# EasyEDA Pro project ProDoc_智能家居扩展板_2024-11-17.epro

# Schematic 智能家居扩展板
Board Name: 智能家居扩展板; Create Date: 2024-08-14; Page Name: P1; Project Name: 树莓派扩展板; Schematic Name: 智能家居扩展板; Update Date: 2024-10-30; Company: 嘉立创EDA; Page Size: A4; Version: V1.0
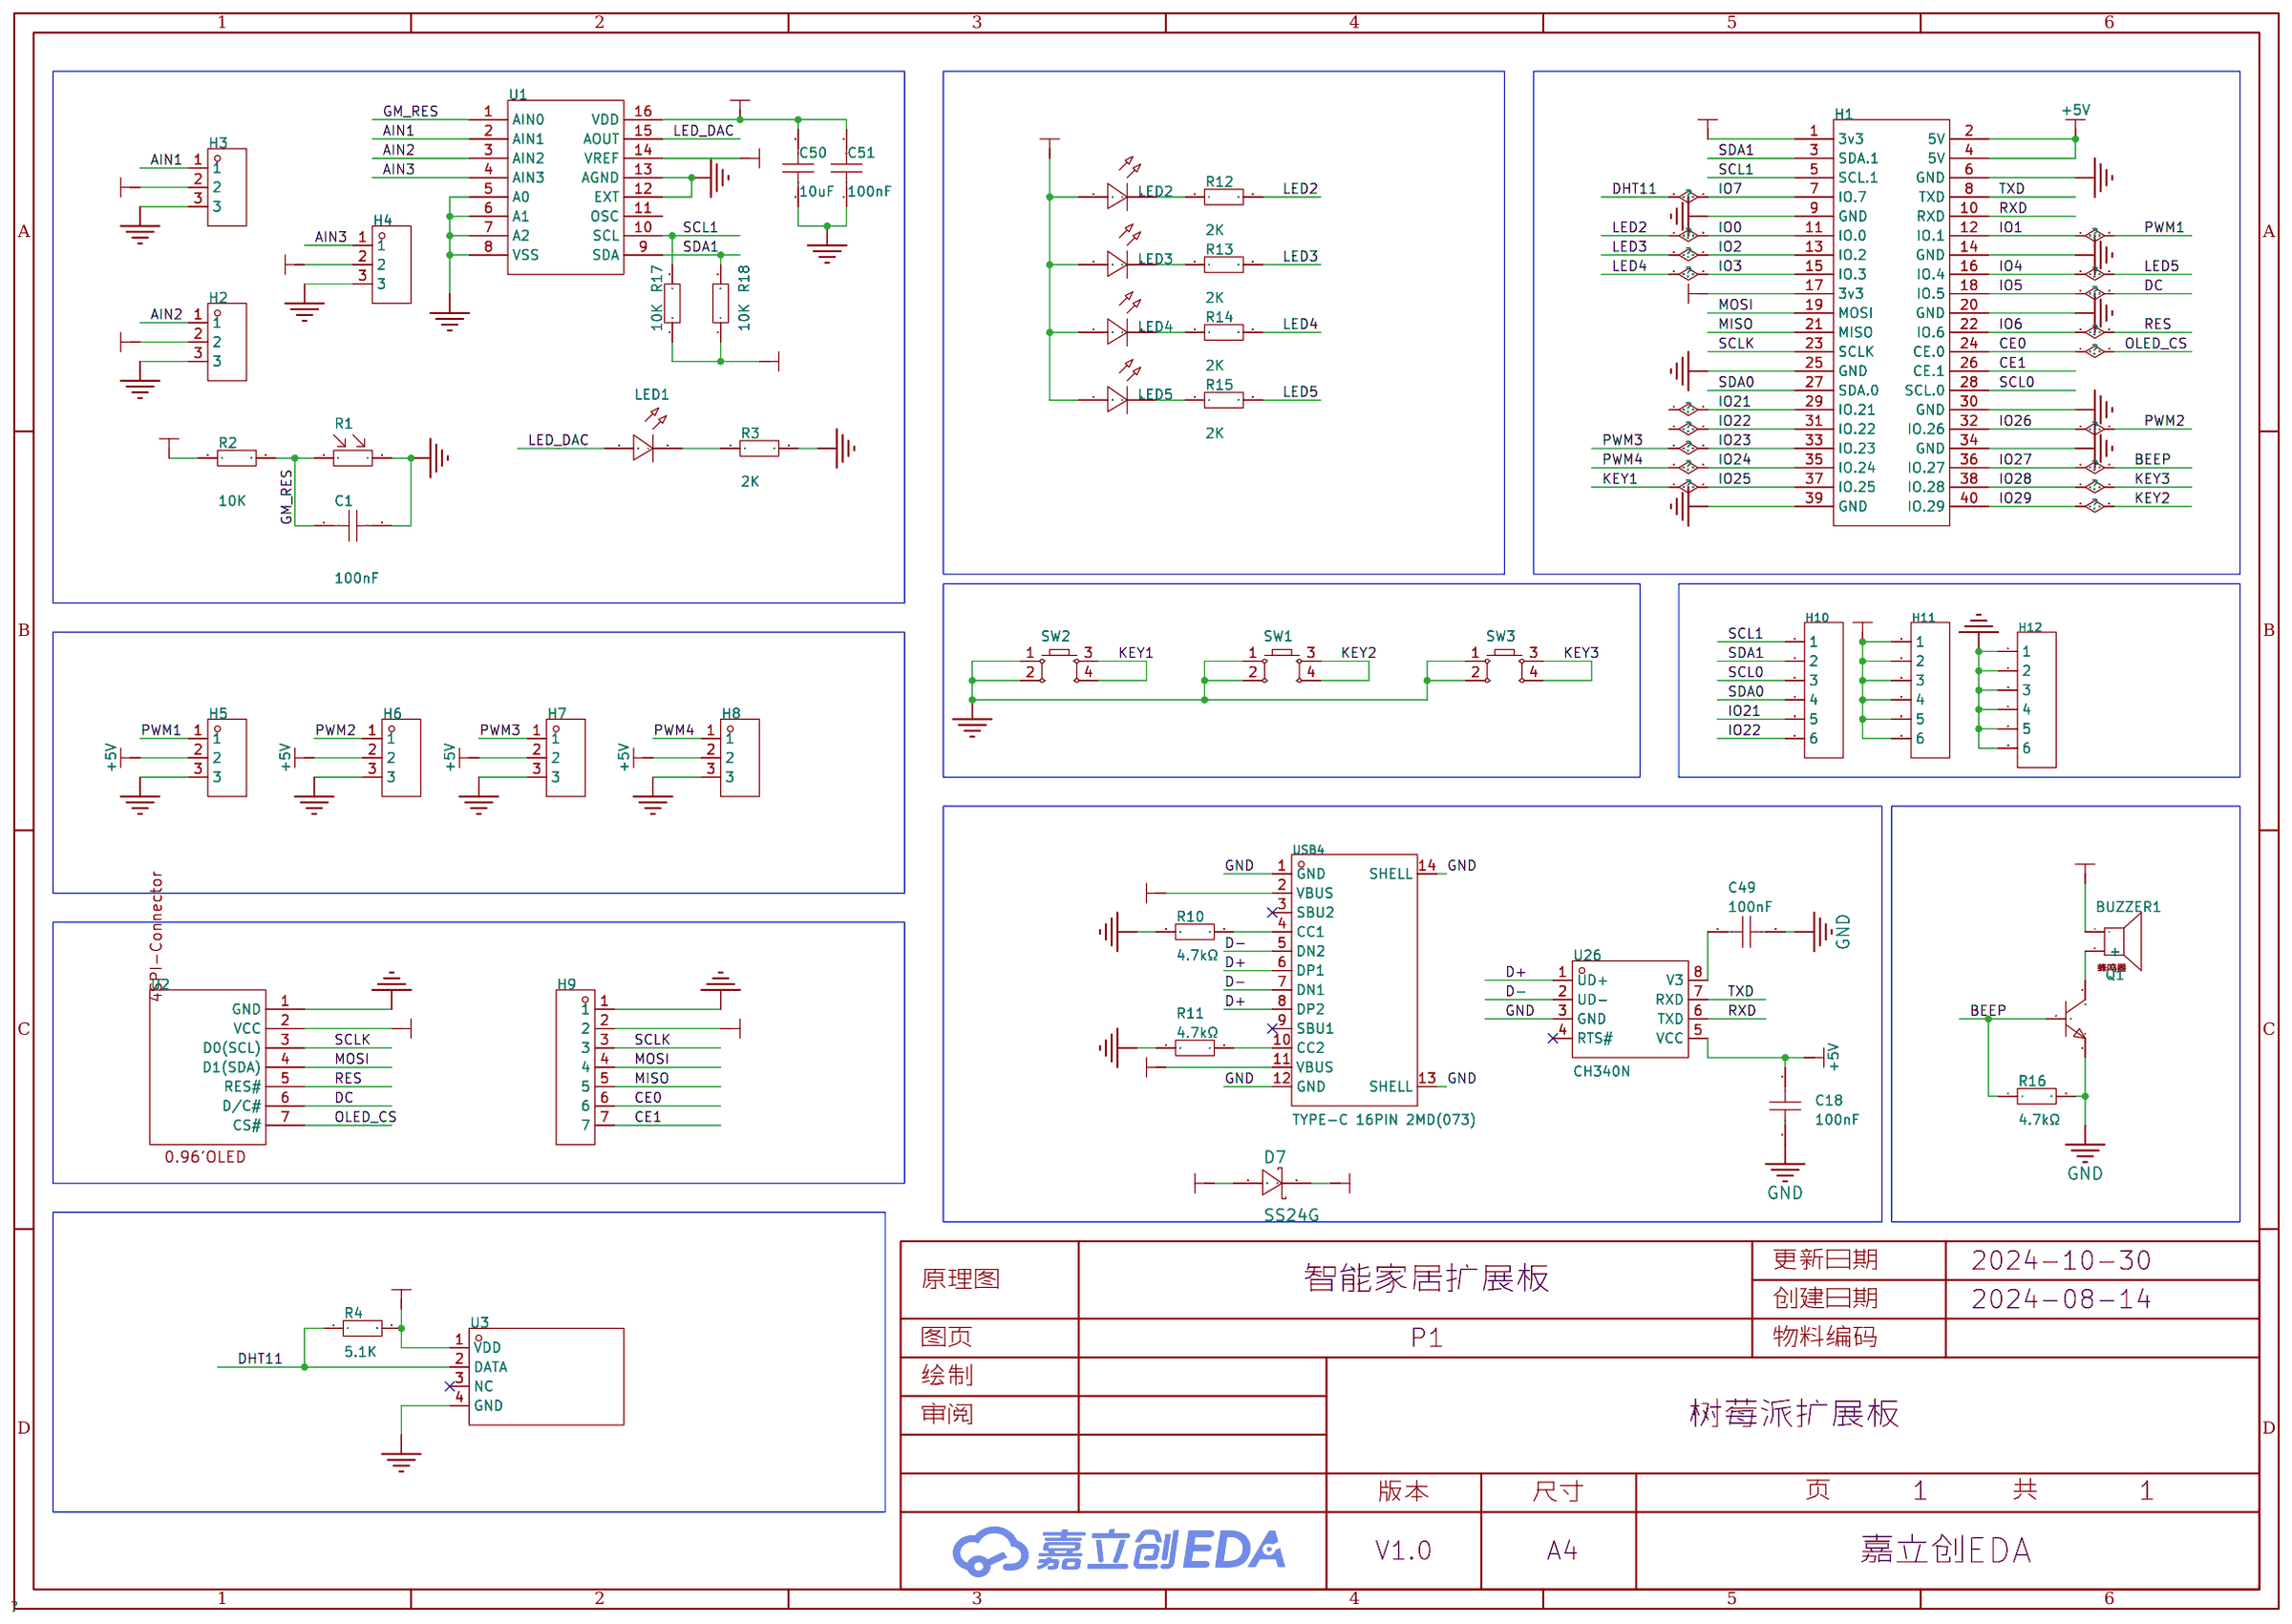
[diagram p0: schematic sheet]

## Parts
BUZZER1  蜂鸣器0905  [蜂鸣器0905]
C1  100nF  [C0603]
C18  100nF  [C0603]
C49  100nF  [C0603]
C50  10uF  [C0603]
C51  100nF  [C0603]
D7  SS24G  [SMA_L4.4-W2.8-LS5.4-RD]
H1  -  [HDR-TH_12P-P2.54-V-M-R2-C6-S2.54]
H2  -  [HDR-TH_3P-P2.54-V-M]
H3  -  [HDR-TH_3P-P2.54-V-M]
H4  -  [HDR-TH_3P-P2.54-V-M]
H5  -  [HDR-TH_3P-P2.54-V-M]
H6  -  [HDR-TH_3P-P2.54-V-M]
H7  -  [HDR-TH_3P-P2.54-V-M]
H8  -  [HDR-TH_3P-P2.54-V-M]
H9  -  [HDR-TH_7P-P2.54-V-M]
H10  -  [HDR-TH_6P-P2.54-V-M-1]
H11  -  [HDR-TH_6P-P2.54-V-M-1]
H12  -  [HDR-TH_6P-P2.54-V-M-1]
LED1  -  [LED_TH-3mm]
LED2  -  [LED_TH-3mm]
LED3  -  [LED_TH-3mm]
LED4  -  [LED_TH-3mm]
LED5  -  [LED_TH-3mm]
Q1  -  [SOT-23-3_L2.9-W1.3-P1.90-LS2.4-BR]
R1  GL5506（4-7K）  [RES-TH_L5.1-W4.3-P3.00-D0.5]
R2  10K  [R0603]
R3  2K  [R0603]
R4  5.1K  [R0603]
R10  4.7kΩ  [R0603]
R11  4.7kΩ  [R0603]
R12  2K  [R0603]
R13  2K  [R0603]
R14  2K  [R0603]
R15  2K  [R0603]
R16  4.7kΩ  [R0603]
R17  10K  [R0603]
R18  10K  [R0603]
SW1  -  [SW-SMD_4P-L6.0-W6.0-P4.50-LS9.0-2]
SW2  -  [SW-SMD_4P-L6.0-W6.0-P4.50-LS9.0-2]
SW3  -  [SW-SMD_4P-L6.0-W6.0-P4.50-LS9.0-2]
U1  PCF8591T/2,518  [SOIC-16_L10.3-W7.5-P1.27-LS10.3-BL]
U2  0.96'OLED-SPI(7Pin)_JX  [OLED-TH_JX040101-1]
U3  DHT11  [sensor-th_dht11]
U26  CH340N  [SOP-8_L4.9-W3.9-P1.27-LS6.0-BL]
USB4  TYPE-C 16PIN 2MD(073)  [USB-C-SMD_TYPE-C-6PIN-2MD-073]

## Library data of the parts
BUZZER1 = 蜂鸣器0905: _: undefined; 3DModel: User Library-Kobitone_Buzzer; Supplier: LCSC; Manufacturer: HNDZ; Manufacturer Part: TMB12A12; Supplier Part: C96079; JLCPCB Part Class: 扩展库
C1 C50 C51 = CAP_0603: Supplier Footprint: 0603
C18 C49 = CC0603KRX7R8BB104: 容值:100nF;精度:±10%;额定电压:25V;材质(温度系数):X7R;; LCSC Part Name: 100nF ±10% 25V; Supplier Part: C92490; Manufacturer: YAGEO(国巨); Supplier Footprint: 0603; JLCPCB Part Class: Extended Part; Datasheet: https://atta.szlcsc.com/upload/public/pdf/source/20170105/1483610795587.pdf; Supplier: LCSC; Tolerance: ±10%; Voltage Rated: 25V; Temperature Coefficient: X7R
D7 = SS24G: Supplier: LCSC; Supplier Part: C183481; Manufacturer: SK; JLCPCB Part Class: Extended Part
H1 = HDR-F_2.54_2x20: Rasspberry; Supplier Part: C92270; Supplier Footprint: 插件
H2-H8 = HDR-M_2.54_1x3P: Supplier Part: C2937625; Supplier Footprint: 插件
H9 = HDR-M_2.54_1x7P: Supplier Part: C492406; Supplier Footprint: 插件
H10-H12 = HDR-M_2.54_1x6P: Supplier Part: C37208; Supplier Footprint: 插件
LED1-LED5 = LED_TH-R_3mm: Supplier Footprint: 插件
Q1 = NPN: 晶体管类型:NPN;集射极击穿电压(Vceo):40V;集电极电流(Ic):600mA;功率(Pd):300mW;集电极-发射极饱和电压(VCE(sat)@Ic,Ib):1V@500mA,50mA;直流电流增益(hFE@Ic,Vce):-;特征频率(fT):300MHz;工作温度:+150℃@(Tj);; LCSC Part Name: MMBT2222A 1P; Supplier Part: C8512; Manufacturer: CJ（江苏长电/长晶）; Manufacturer Part: MMBT2222A 1P; Supplier Footprint: SOT-23(SOT-23-3); JLCPCB Part Class: Basic Part; Datasheet: https://atta.szlcsc.com/upload/public/pdf/source/20140815/1457707223705.pdf; Supplier: LCSC; Collector-Emitter Breakdown Voltage (Vceo): 40V; Collector Current (Ic): 600mA; Power Dissipation (Pd): 300mW; Collector-Emitter Saturation Voltage (VCE(sat)@Ic,Ib): 1V@500mA,50mA; Transition Frequency (fT): 300MHz; Operating Temperature: +150℃@(Tj)
R1 = GL5506(4-7K): 光谱峰值(波长):540nm;最大电压:150V;亮电阻 @ 10Lux:4kΩ~7kΩ;暗电阻:500kΩ;; LCSC Part Name: GL5506（4-7K）不环保; Supplier Part: C11299; Manufacturer: JCHL(晶创和立); Supplier Footprint: 插件,P=3mm; JLCPCB Part Class: Extended Part; Datasheet: https://atta.szlcsc.com/upload/public/pdf/source/20151026/1457707497809.pdf; Supplier: LCSC; Spectral Peak: 540nm; Applied Voltage: 150V; Illuminated Resistance @ 10Lux: 4kΩ~7kΩ; Dark Resistance: 500kΩ
R2-R4 R12-R15 R17 R18 = Res_0603: Supplier Footprint: 0603
R10 R11 R16 = 0603WAF4701T5E: 电阻类型:厚膜电阻;阻值:4.7kΩ;精度:±1%;功率:100mW;最大工作电压:75V;温度系数:±100ppm/℃;; LCSC Part Name: 4.7kΩ ±1% 100mW 厚膜电阻; Supplier Part: C23162; Manufacturer: UNI-ROYAL(厚声); Supplier Footprint: 0603; JLCPCB Part Class: Basic Part; Datasheet: https://atta.szlcsc.com/upload/public/pdf/source/20200306/C422600_1E6D84923E4A46A82E41ADD87F860B5C.pdf; Supplier: LCSC; Type: 厚膜电阻; Tolerance: ±1%; Power(Watts): 100mW; Overload Voltage (Max): 75V; Temperature Coefficient: ±100ppm/℃; Operating Temperature Range: -55℃~+155℃
SW1-SW3 = Key_SMD_6x6x6.5: Supplier Footprint: SMD
U1 = PCF8591T/2,518: LCSC Part Name: PCF8591T/2,518 停产; Supplier Part: C8366; Manufacturer: NXP(恩智浦); Supplier Footprint: SOIC-16-300mil; JLCPCB Part Class: 扩展库; Supplier: LCSC
U2 = 0.96'OLED-SPI(7Pin)_JX: Supplier Part: C9900004517; Supplier Footprint: 插件; JLCPCB Part Class: 扩展库; Supplier: LCSC
U3 = DHT11: 新款电容式数字温湿度传感器,老款已停产16.1x12.6x5.8mm; LCSC Part Name: DHT11  电容式传感器; Supplier Part: C117051; Manufacturer: 广州奥松; Supplier Footprint: SIP-4; JLCPCB Part Class: Extended Part; Datasheet: https://atta.szlcsc.com/upload/public/pdf/source/20170703/1499081238365.pdf; Supplier: LCSC
U26 = CH340N: LCSC Part Name: USB转串口芯片 CH340; Supplier Part: C2977777; Manufacturer: WCH(南京沁恒); Supplier Footprint: SOP-8; JLCPCB Part Class: 扩展库; Datasheet: https://atta.szlcsc.com/upload/public/pdf/source/20230530/6E401E9554E9F5311886CC8B3F89B62E.pdf; Supplier: LCSC
USB4 = TYPE-C 16PIN 2MD(073): 连接器类型:Type-C;标准:-;公母:母座;触点数量:16;端口数量:1;安装方式:卧贴;额定电流 - 电源:5A;工作温度范围:-25℃~+85℃;; LCSC Part Name: TYPE-C母座 16P 4脚插件带定位柱 不锈钢外壳 2次模顶; Supplier Part: C2765186; Manufacturer: SHOU HAN(首韩); Supplier Footprint: SMD; JLCPCB Part Class: 扩展库; Supplier: LCSC; Connector Type: Type-C; Gender: 母座; Number of Contacts: 16; Number of Ports: 1; Mounting Style: 卧贴; Current Rating - Power (Max): 5A; Operating Temperature Range: -25℃~+85℃

## Nets
3V3: BUZZER1.- C50.2 C51.2 H1.1(3v3) H1.17(3v3) H2.2 H3.2 H4.2 H9.2 H11.1 H11.2 H11.3 H11.4 H11.5 H11.6 LED2.1(C) LED3.1(C) LED4.1(C) LED5.1(C) R2.1 R4.2 R17.1 R18.1 U1.14(VREF) U1.16(VDD) U2.2(VCC) U3.1(VDD)
+5V: C18.2 D7.1 H1.2(5V) H1.4(5V) H5.2 H6.2 H7.2 H8.2 U26.5(VCC)
GND: C1.2 C18.1 C49.2 C50.1 C51.1 H1.6(GND) H1.9(GND) H1.14(GND) H1.20(GND) H1.25(GND) H1.30(GND) H1.34(GND) H1.39(GND) H2.3 H3.3 H4.3 H5.3 H6.3 H7.3 H8.3 H9.1 H12.1 H12.2 H12.3 H12.4 H12.5 H12.6 Q1.2(E) R1.2 R3.2 R10.1 R11.1 R16.2 SW1.1 SW1.2 SW2.1 SW2.2 SW3.1 SW3.2 U1.5(A0) U1.6(A1) U1.7(A2) U1.8(VSS) U1.12(EXT) U1.13(AGND) U2.1(GND) U3.4(GND) U26.3(GND) USB4.1(GND) USB4.12(GND) USB4.13(SHELL) USB4.14(SHELL)
VBUS: D7.2 USB4.2(VBUS) USB4.11(VBUS)
AIN1: H3.1 U1.2(AIN1)
AIN2: H2.1 U1.3(AIN2)
AIN3: H4.1 U1.4(AIN3)
BEEP: H1.36(IO.27) Q1.1(B) R16.1
CE0: H1.24(CE.0) H9.6 U2.7(CS#)
CE1: H1.26(CE.1) H9.7
D+: U26.1(UD+) USB4.6(DP1) USB4.8(DP2)
D-: U26.2(UD-) USB4.5(DN2) USB4.7(DN1)
DC: H1.18(IO.5) U2.6(D/C#)
DHT11: H1.7(IO.7) R4.1 U3.2(DATA)
GM_RES: C1.1 R1.1 R2.2 U1.1(AIN0)
IO0: H1.11(IO.0) R12.2
IO1: H1.12(IO.1) H5.1
IO2: H1.13(IO.2) R13.2
IO3: H1.15(IO.3) R14.2
IO4: H1.16(IO.4) R15.2
IO6: H1.22(IO.6) U2.5(RES#)
IO21: H1.29(IO.21) H10.5
IO22: H1.31(IO.22) H10.6
IO23: H1.33(IO.23) H7.1
IO24: H1.35(IO.24) H8.1
IO25: H1.37(IO.25) SW2.3 SW2.4
IO26: H1.32(IO.26) H6.1
IO28: H1.38(IO.28) SW3.3 SW3.4
IO29: H1.40(IO.29) SW1.3 SW1.4
LED_DAC: LED1.1(C) U1.15(AOUT)
MISO: H1.21(MISO) H9.5
MOSI: H1.19(MOSI) H9.4 U2.4(D1(SDA))
RXD: H1.10(RXD) U26.6(TXD)
SCL0: H1.28(SCL.0) H10.3
SCL1: H1.5(SCL.1) H10.1 R17.2 U1.10(SCL)
SCLK: H1.23(SCLK) H9.3 U2.3(D0(SCL))
SDA0: H1.27(SDA.0) H10.4
SDA1: H1.3(SDA.1) H10.2 R18.2 U1.9(SDA)
TXD: H1.8(TXD) U26.7(RXD)
$1N1552: LED1.2(A) R3.1
$1N3312: R10.2 USB4.4(CC1)
$1N3313: R11.2 USB4.10(CC2)
$1N3325: C49.1 U26.8(V3)
$1N3429: LED2.2(A) R12.1
$1N3496: LED3.2(A) R13.1
$1N3547: LED4.2(A) R14.1
$1N3598: LED5.2(A) R15.1
$1N4766: BUZZER1.+ Q1.3(C)

Not connected (* = marked no-connect by the designer): U1 11(OSC); U3 3(NC)*; U26 4(RTS#)*; USB4 3(SBU2)* 9(SBU1)*

# Board PCB1
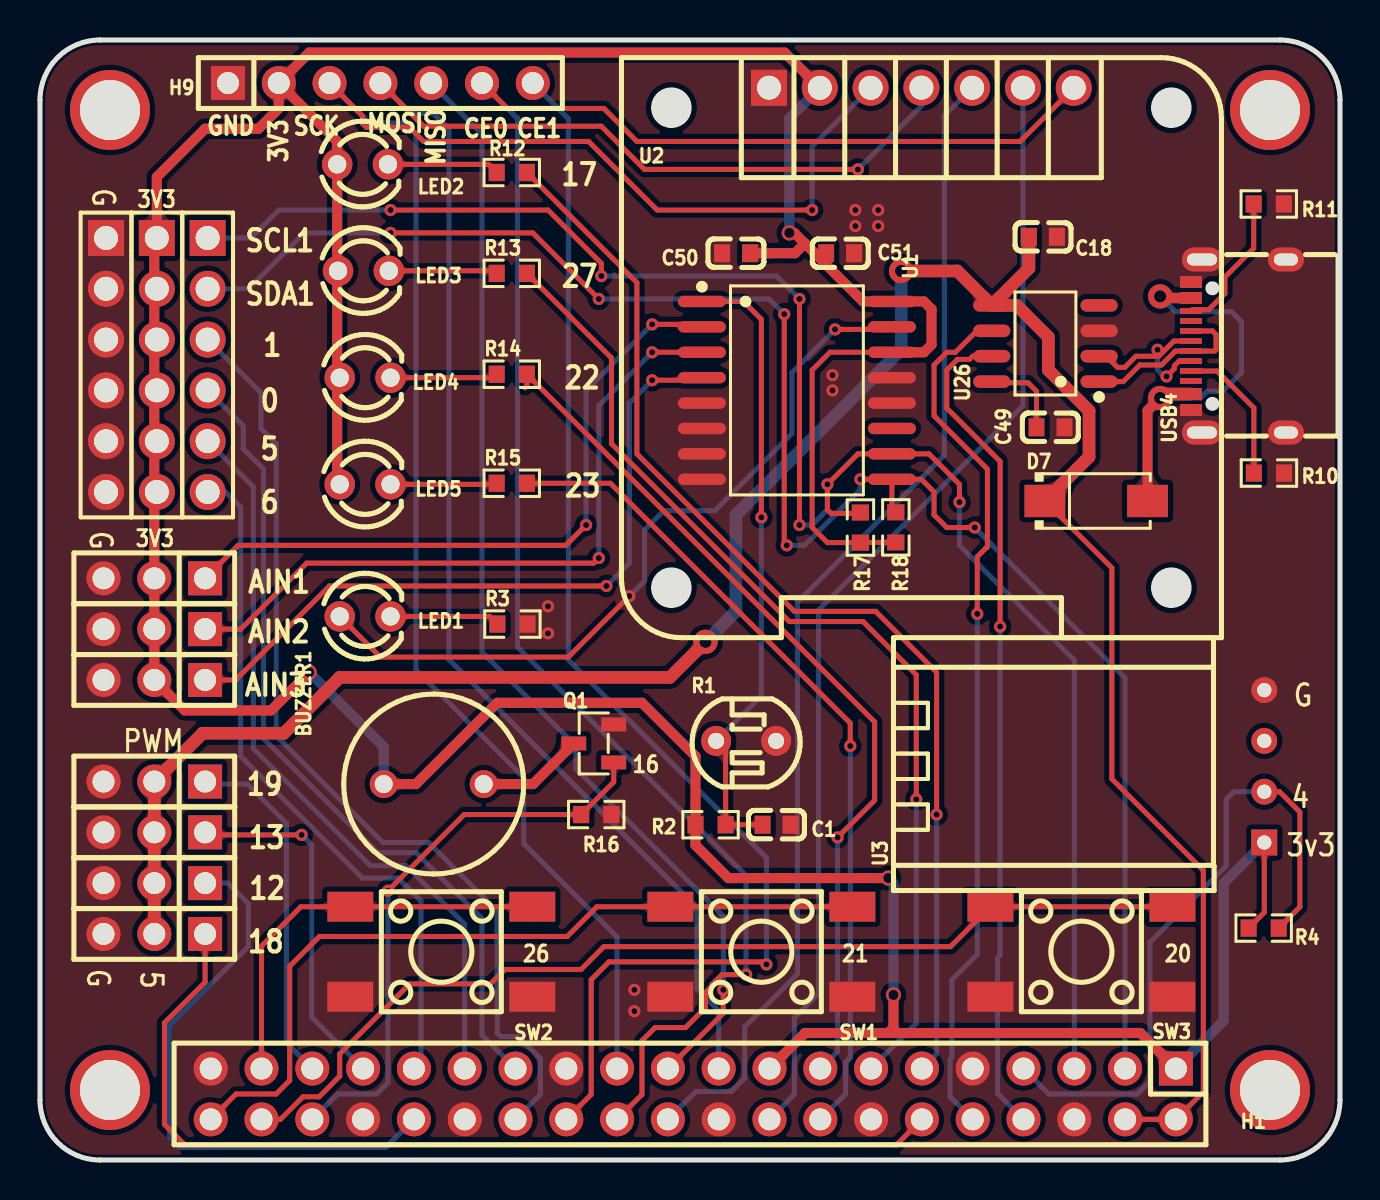
[diagram p1: board, top side]
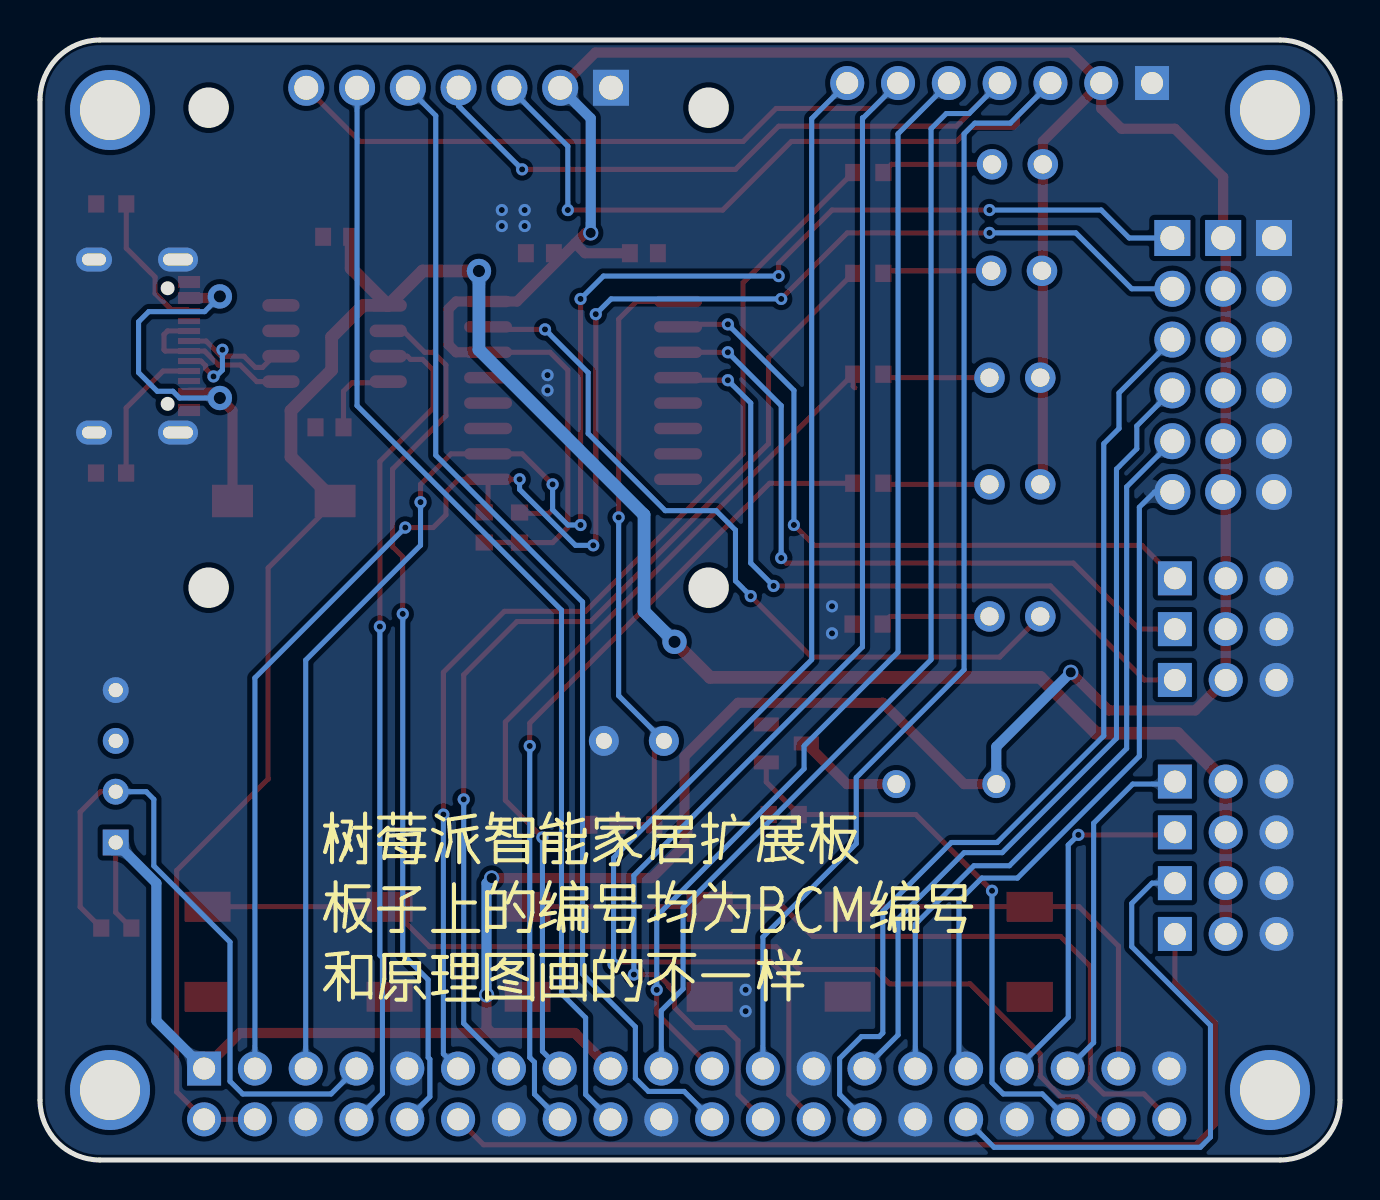
[diagram p2: board, bottom side, seen from below]

Outline 65 x 56 mm; copper layers: Top Layer, Bottom Layer. Coordinates in mm from the lower left corner of the outline.
Outline path: 0,53 0,3 arc(0.88,0.88) 3,0 62,0 arc(64.12,0.88) 65,3 65,53 arc(64.12,55.12) 62,56 3,56 arc(0.88,55.12) 0,53
Stack: Top Layer 0.035mm / Dielectric1 1.51mm FR4 er 4.5 / Bottom Layer 0.035mm

## Design rules (mm)
net D+: DP1
net D-: DP1
template: 自定义配置
spacing copperThickness1oz (default): track to track 0.102, other pairs 0.152 to 0.3
spacing copperThickness2oz: track to track 0.203, other pairs 0.152 to 0.3
track width copperThickness1oz (default): min 0.127, default 0.254, max 2.54
track width copperThickness2oz: min 0.203, default 0.254, max 2.54
differential pair differentialPair (default): width min 0.127, default 0.254, max 2.54; gap min 0.152, default 0.152
via viaSize (default): diameter min 0.5, default 0.61, max 10; hole min 0.3, default 0.305, max 6.3

## Placement (name value [footprint] x y rotation side)
BUZZER1  -  [蜂鸣器0905]  19.69 18.8 180 top
C1  100nF  [C0603]  36.83 16.76 0 top
C18  100nF  [C0603]  50.14 46.16 180 top
C49  100nF  [C0603]  50.53 36.63 0 top
C50  10uF  [C0603]  34.81 45.34 0 top
C51  100nF  [C0603]  40 45.34 180 top
D7  SS24G  [SMA_L4.4-W2.8-LS5.4-RD]  52.81 32.95 0 top
G  -  [HDR-TH_6P-P2.54-V-M-1]  3.3 39.75 270 top
H1  -  [HDR-TH_12P-P2.54-V-M-R2-C6-S2.54]  50.44 3.3 180 top
H2  -  [HDR-TH_3P-P2.54-V-M]  5.72 26.54 180 top
H3  -  [HDR-TH_3P-P2.54-V-M]  5.72 29.08 180 top
H4  -  [HDR-TH_3P-P2.54-V-M]  5.72 24 180 top
H5  -  [HDR-TH_3P-P2.54-V-M]  5.72 11.3 180 top
H6  -  [HDR-TH_3P-P2.54-V-M]  5.72 13.84 180 top
H7  -  [HDR-TH_3P-P2.54-V-M]  5.72 16.38 180 top
H8  -  [HDR-TH_3P-P2.54-V-M]  5.72 18.92 180 top
H9  -  [HDR-TH_7P-P2.54-V-M]  17.02 53.85 0 top
H10  -  [HDR-TH_6P-P2.54-V-M-1]  8.38 39.75 270 top
H11  -  [HDR-TH_6P-P2.54-V-M-1]  5.84 39.75 270 top
LED1  -  [LED_TH-3mm]  16.26 27.18 0 top
LED2  -  [LED_TH-3mm]  16.13 49.78 0 top
LED3  -  [LED_TH-3mm]  16.17 44.46 0 top
LED4  -  [LED_TH-3mm]  16.26 39.12 0 top
LED5  -  [LED_TH-3mm]  16.26 33.78 0 top
NOREF  -  [Pad_e5]  61.5 52.5 0 top
NOREF#2  -  [Pad_e1]  3.5 3.5 0 top
NOREF#3  -  [Pad_e4]  3.5 52.5 0 top
NOREF#4  -  [Pad_e3]  61.5 3.5 0 top
Q1  -  [SOT-23-3_L2.9-W1.3-P1.90-LS2.4-BR]  27.69 20.83 0 top
R1  GL5506（4-7K）  [RES-TH_L5.1-W4.3-P3.00-D0.5]  35.31 20.95 0 top
R2  10K  [R0603]  33.53 16.76 0 top
R3  2K  [R0603]  23.62 26.8 0 top
R4  5.1K  [R0603]  61.18 11.6 180 top
R10  4.7kΩ  [R0603]  61.45 34.35 180 top
R11  4.7kΩ  [R0603]  61.44 47.8 180 top
R12  2K  [R0603]  23.59 49.37 0 top
R13  2K  [R0603]  23.59 44.33 0 top
R14  2K  [R0603]  23.59 39.29 0 top
R15  2K  [R0603]  23.59 33.84 0 top
R16  4.7kΩ  [R0603]  27.81 17.27 0 top
R17  10K  [R0603]  41.02 31.62 90 top
R18  10K  [R0603]  42.79 31.63 90 top
SW1  -  [SW-SMD_4P-L6.0-W6.0-P4.50-LS9.0-2]  36.07 10.41 180 top
SW2  -  [SW-SMD_4P-L6.0-W6.0-P4.50-LS9.0-2]  20.07 10.41 180 top
SW3  -  [SW-SMD_4P-L6.0-W6.0-P4.50-LS9.0-2]  52.07 10.41 180 top
U1  PCF8591T/2,518  [SOIC-16_L10.3-W7.5-P1.27-LS10.3-BL]  37.85 38.48 270 top
U2  0.96'OLED-SPI(7Pin)_JX  [OLED-TH_JX040101-1]  44.07 53.61 0 top
U3  DHT11  [sensor-th_dht11]  61.21 19.69 90 top
U26  CH340N  [SOP-8_L4.9-W3.9-P1.27-LS6.0-BL]  50.27 40.83 90 top
USB4  TYPE-C 16PIN 2MD(073)  [USB-C-SMD_TYPE-C-6PIN-2MD-073]  59.92 40.7 90 top

## Footprints (pads in the part's own frame, mm; a bottom-side part is the same pattern mirrored in y, then rotated)
C0603
  rect 0.8x0.9 smd: 1(-0.7,0) 2(0.7,0)
HDR-TH_3P-P2.54-V-M
  rect 1.7x1.7 hole 1.1: 1(-2.54,0)
  round 1.7 hole 1.1: 2(0,0) 3(2.54,0)
HDR-TH_6P-P2.54-V-M-1
  rect 1.8x1.8 hole 1.2: 1(-6.35,0)
  round 1.8 hole 1.2: 2(-3.81,0) 3(-1.27,0) 4(1.27,0) 5(3.81,0) 6(6.35,0)
HDR-TH_7P-P2.54-V-M
  rect 1.7x1.7 hole 1.1: 1(-7.62,0)
  round 1.7 hole 1.1: 2(-5.08,0) 3(-2.54,0) 4(0,0) 5(2.54,0) 6(5.08,0) 7(7.62,0)
HDR-TH_12P-P2.54-V-M-R2-C6-S2.54
  rect 1.7x1.7 hole 1.1: 1(-6.35,-1.27)
  round 1.7 hole 1.1: 2(-6.35,1.27) 3(-3.81,-1.27) 4(-3.81,1.27) 5(-1.27,-1.27) 6(-1.27,1.27) 7(1.27,-1.27) 8(1.27,1.27) 9(3.81,-1.27) 10(3.81,1.27) 11(6.35,-1.27) 12(6.35,1.27) 13(8.89,-1.27) 14(8.89,1.27) 15(11.43,-1.27) 16(11.43,1.27) 17(13.97,-1.27) 18(13.97,1.27) 19(16.51,-1.27) 20(16.51,1.27) 21(19.05,-1.27) 22(19.05,1.27) 23(21.59,-1.27) 24(21.59,1.27) 25(24.13,-1.27) 26(24.13,1.27) 27(26.67,-1.27) 28(26.67,1.27) 29(29.21,-1.27) 30(29.21,1.27) 31(31.75,-1.27) 32(31.75,1.27) 33(34.29,-1.27) 34(34.29,1.27) 35(36.83,-1.27) 36(36.83,1.27) 37(39.37,-1.27) 38(39.37,1.27) 39(41.91,-1.27) 40(41.91,1.27)
LED_TH-3mm
  round 1.524 hole 0.914: 1(-1.27,0) 2(1.27,0)
OLED-TH_JX040101-1
  rect 1.8x1.8 hole 1.2: 1(-7.619,0.002)
  round 1.8 hole 1.2: 2(-5.079,-0.004) 3(-2.538,-0.004) 4(0.002,0.004) 5(2.538,-0.002) 6(5.079,-0.002) 7(7.619,-0.004)
Pad_e1
  round 4 hole 3: 1(0,0)
Pad_e3
  round 4 hole 3: 1(0,0)
Pad_e4
  round 4 hole 3: 1(0,0)
Pad_e5
  round 4 hole 3: 1(0,0)
R0603
  rect 0.806x0.864 smd: 1(-0.753,0) 2(0.753,0)
RES-TH_L5.1-W4.3-P3.00-D0.5
  round 1.5 hole 0.8: 1(-1.5,0) 2(1.5,0)
sensor-th_dht11
  rect 1.296x1.296 hole 0.711: 1(-3.81,0)
  round 1.296 hole 0.711: 2(-1.27,0) 3(1.27,0) 4(3.81,0)
SMA_L4.4-W2.8-LS5.4-RD
  rect 2.046x1.62 smd: 1(-2.566,0) 2(2.566,0)
SOIC-16_L10.3-W7.5-P1.27-LS10.3-BL
  oval 0.574x2.401 smd: 1(-4.445,-4.75) 2(-3.175,-4.75) 3(-1.905,-4.75) 4(-0.635,-4.75) 5(0.635,-4.75) 6(1.905,-4.75) 7(3.175,-4.75) 8(4.445,-4.75) 9(4.445,4.75) 10(3.175,4.75) 11(1.905,4.75) 12(0.635,4.75) 13(-0.635,4.75) 14(-1.905,4.75) 15(-3.175,4.75) 16(-4.445,4.75)
SOP-8_L4.9-W3.9-P1.27-LS6.0-BL
  oval 0.63x1.865 smd: 1(-1.905,-2.683) 2(-0.635,-2.683) 3(0.635,-2.683) 4(1.905,-2.683) 5(1.905,2.683) 6(0.635,2.683) 7(-0.635,2.683) 8(-1.905,2.683)
SOT-23-3_L2.9-W1.3-P1.90-LS2.4-BR
  rect 1.25x0.7 smd: 1(1,-0.95) 2(1,0.95) 3(-1,0)
SW-SMD_4P-L6.0-W6.0-P4.50-LS9.0-2
  rect 2.3x1.5 smd: 1(-4.55,2.25) 2(4.55,2.25) 3(-4.55,-2.25) 4(4.55,-2.25)
USB-C-SMD_TYPE-C-6PIN-2MD-073
  rect 0.6x1.1 smd: 1(-3.2,2.375) 2(-2.4,2.375) 11(2.4,2.375) 12(3.2,2.375)
  rect 0.3x1.1 smd: 3(-1.75,2.375) 4(-1.25,2.375) 5(-0.75,2.375) 6(-0.25,2.375) 7(0.25,2.375) 8(0.75,2.375) 9(1.25,2.375) 10(1.75,2.375)
  oval 1.2x2 hole 0.6x1.5: 13(-4.325,1.825) 14(4.325,1.825)
  oval 1.2x1.8 hole 0.6x1.2: 13(-4.325,-2.375) 14(4.325,-2.375)
蜂鸣器0905
  round 1.4 hole 0.9: +(-2.5,0) -(2.5,0)

## Nets
As in the schematic, except:
GND: C1.2 C18.1 C49.2 C50.1 C51.1 G.1 G.2 G.3 G.4 G.5 G.6 H1.6 H1.9 H1.14 H1.20 H1.25 H1.30 H1.34 H1.39 H2.3 H3.3 H4.3 H5.3 H6.3 H7.3 H8.3 H9.1 Q1.2 R1.2 R3.2 R10.1 R11.1 R16.2 SW1.1 SW1.2 SW2.1 SW2.2 SW3.1 SW3.2 U1.5 U1.6 U1.7 U1.8 U1.12 U1.13 U2.1 U3.4 U26.3 USB4.1 USB4.12 USB4.13 USB4.14

Pads without a net: NOREF 1; NOREF#2 1; NOREF#3 1; NOREF#4 1; U1 11; U3 3; U26 4; USB4 3 9

## Via types
v1: diameter 0.762, hole 0.508, Top Layer to Bottom Layer, 4 vias
v2: diameter 1.219, hole 0.61, Top Layer to Bottom Layer, 4 vias
v3: diameter 0.61, hole 0.305, Top Layer to Bottom Layer, 46 vias

## Routing (per net, layer and track width the routed paths; a pad name or vN(x,y) marks a point on that pad's centre or on a via; arc(x,y) is an arc through that point)
3V3: length 220.8
  Top Layer w0.254: R4.2 61.21,12.38 U3.1 ; U1.14 39.5,40.39 38.61,39.5 38.61,31.63 39.37,30.87 R17.1 41.03,30.88 R18.1
  Top Layer w0.508: 42.41,6.35 55.02,6.35 H1.1 ; 42.41,6.35 42.67,6.61 v1(42.67,8.25) ; 42.41,6.35 38.25,6.35 H1.17 ; LED5.1 14.86,33.91 14.86,50.93 H9.2 ; BUZZER1.- 18.8,18.8 22.86,22.86 30.1,22.86 32.77,20.18 R2.1 32.77,15.74 34.42,14.1 v1(42.42,14.1) ; 38.24,45.83 37.75,45.34 C50.2 ; 38.24,45.83 37.72,46.36 v1(37.47,46.36) ; 38.24,45.83 41.15,42.93 U1.16 44.2,42.93 44.58,42.55 44.58,40.77 44.2,40.39 U1.14 ; v1(13.46,24.38) 11.56,22.48 7.24,22.48 H4.2 H2.2 H3.2 5.72,45.97 H11.1 5.84,49.15 8.25,51.56 10.92,51.56 11.94,52.58 H9.2 ; H9.2 13.46,55.37 37.23,55.37 U2.2
  Bottom Layer w0.508: v1(42.67,8.25) 42.67,13.84 v1(42.42,14.1) ; U2.2 37.47,52.08 v1(37.47,46.36) ; H1.1 59.18,6.96 59.18,13.84 U3.1 ; BUZZER1.- 17.19,20.66 v1(13.46,24.38)
+5V: length 120.9
  Top Layer w0.254: H1.4 H1.2 58.17,3.4 58.17,14.48 53.59,19.05 53.59,29.6 D7.1
  Top Layer w0.635: U26.5 49.44,44.59 C18.2 ; U26.5 48.84,42.73 50.42,41.15 50.42,39.5 52.45,37.47 52.45,35.16 D7.1 ; U26.5 45.87,44.45 v2(43.05,44.45) ; H5.2 H6.2 H7.2 H8.2 8.13,21.34 12.19,21.34 14.99,24.13 31.5,24.13 v2(33.27,25.91)
  Bottom Layer w0.635: v2(43.05,44.45) 43.05,40.51 34.8,32.26 34.8,27.43 v2(33.27,25.91)
GND:
  vias: v3(25.4,27.69) v3(25.4,26.33) v3(29.72,8.51) v3(29.72,7.44) v3(39.62,39.24) v3(39.62,38.48) v3(40.77,47.5) v3(40.77,46.7) v3(41.91,47.5) v3(41.91,46.7)
VBUS: length 20.3
  Top Layer w0.508: v2(56.01,43.18) 56.09,43.1 USB4.11 ; D7.2 55.38,37.47 v2(56.01,38.1)
  Top Layer w0.635: v2(56.01,38.1) 56.21,38.3 USB4.2
  Bottom Layer w0.254: v2(56.01,43.18) 56.77,42.42 59.56,42.42 60.07,41.91 60.07,39.37 59.14,38.44 58.36,38.44 58.02,38.1 v2(56.01,38.1)
AIN1: length 34.1
  Top Layer w0.254: v3(27.31,31.75) 26.29,30.73 9.91,30.73 H3.1 ; v3(30.61,41.78) 32.97,41.78 U1.2
  Bottom Layer w0.254: v3(30.61,41.78) 27.31,38.48 v3(27.31,31.75)
AIN2: length 35
  Top Layer w0.254: v3(27.94,30.1) 27.69,29.84 13.34,29.84 10.03,26.54 H2.1 ; v3(30.61,40.39) U1.3
  Bottom Layer w0.254: v3(30.61,40.39) 27.94,37.72 v3(27.94,30.1)
AIN3: length 35.8
  Top Layer w0.254: H4.1 9.78,24 14.48,28.7 v3(28.32,28.7) ; v3(30.61,38.99) 32.97,38.99 U1.4
  Bottom Layer w0.254: v3(30.61,38.99) 29.46,37.85 29.46,29.84 v3(28.32,28.7)
BEEP: length 28.7
  Top Layer w0.254: v3(17.4,13.46) 21.21,17.27 R16.1 28.69,18.9 Q1.1
  Bottom Layer w0.254: v3(17.4,13.46) 17.4,3.86 16.84,3.3 14.88,3.3 H1.36
CE0: length 93.5
  Top Layer w0.254: v3(35.31,9.27) 34.1,9.27 33.58,8.75 33.58,8.69 33.27,8.38 33.27,7.62 32.27,6.62 30.75,6.62 30.1,5.97 30.1,3.28 H1.24 ; U2.7 49.01,50.93 29.84,50.93 28.19,52.58 23.37,52.58 H9.6
  Bottom Layer w0.254: H9.6 23.84,52.11 23.88,52.11 23.88,25.65 35.31,14.22 v3(35.31,9.27)
CE1: length 65.6
  Top Layer w0.254: v3(36.32,9.78) 36.19,9.91 28.45,9.91 27.56,9.02 27.56,3.28 H1.26
  Bottom Layer w0.254: v3(36.32,9.78) 36.32,15.11 26.42,25.02 26.42,52.07 H9.7
D+: length 8.6
  Top Layer w0.254: U26.1 54.16,38.92 54.99,39.75 56.07,39.75 56.77,40.45 USB4.6 58.74,40.45 58.8,40.51 58.8,41.28 58.62,41.45 57.81,41.45 57.8,41.45 USB4.8
D-: length 8.6
  Top Layer w0.254: USB4.7 56.7,40.95 55.94,40.19 54.79,40.19 54.23,39.63 53.87,39.63 53.31,40.19 U26.2 ; USB4.5 56.95,39.95 56.72,39.71 56.72,39.57 v3(56.33,39.18)
  Bottom Layer w0.254: v3(56.33,39.18) 56.2,39.18 55.88,39.5 v3(55.88,40.51)
DC: length 56.8
  Bottom Layer w0.254: H1.18 37.72,3.28 37.72,7.11 38.93,8.32 38.93,27.5 49.15,37.72 U2.6
DHT11: length 33.3
  Top Layer w0.254: U3.2 61.98,18.42 62.99,17.4 62.99,12.65 R4.1
  Bottom Layer w0.254: U3.2 59.69,18.42 59.31,18.03 59.31,14.71 55.5,10.9 55.5,3.94 54.86,3.3 50.44,3.3 49.18,4.57
GM_RES: length 31.6
  Top Layer w0.254: C1.1 R2.2 34.28,20.48 R1.1 ; U1.1 35.18,42.93 36.07,42.04 v3(36.07,32.13)
  Bottom Layer w0.254: v3(36.07,32.13) 36.07,23.22 R1.1
IO0: length 56
  Top Layer w0.254: R12.2 29.84,43.87 29.84,35.31 37.72,27.43 41.78,27.43 44.83,24.38 v3(44.83,17.27)
  Bottom Layer w0.254: H1.11 44.83,5.31 v3(44.83,17.27)
IO1: length 49.2
  Top Layer w0.254: H1.12 42.82,0.76 7.24,0.76 6.22,1.78 6.22,6.86 8.25,8.89 H5.1
IO2: length 50.9
  Top Layer w0.254: R13.2 28.57,40.1 28.57,35.81 37.47,26.92 41.15,26.92 43.81,24.26 v3(43.81,18.03)
  Bottom Layer w0.254: v3(43.81,18.03) 43.81,6.83 H1.13
IO3: length 43.8
  Top Layer w0.254: 24.26,38.61 24.34,38.69 R14.2 41.73,21.9 41.73,17.98 v3(39.88,16.13)
  Bottom Layer w0.254: v3(39.88,16.13) 39.88,5.44 H1.15
IO4: length 41.6
  Top Layer w0.254: v3(40.51,20.7) 40.51,21.84 28.52,33.84 R15.2
  Bottom Layer w0.254: v3(40.51,20.7) 40.51,5.13 40.28,4.89 40.28,3.29 H1.16
IO6: length 58.9
  Bottom Layer w0.254: 31.4,2.03 32.79,3.43 34.58,3.43 35.23,4.08 35.23,6.66 37.87,9.3 37.87,27.9 45.21,35.24 45.21,52.22 U2.5
IO21: length 37.7
  Bottom Layer w0.254: 21.24,4.57 21.24,11.78 18.31,14.71 16.53,14.71 10.67,20.57 10.67,33.66 H10.5
IO22: length 35
  Bottom Layer w0.254: H1.31 19.05,4.93 19.05,12.95 17.91,14.1 16.13,14.1 10.03,20.19 10.03,32.64 9.27,33.4 8.38,33.4
IO23: length 17.8
  Top Layer w0.254: H7.1 8.38,16.26 v3(13.08,16.26)
  Bottom Layer w0.254: H1.33 13.59,7.14 13.59,15.75 v3(13.08,16.26)
IO24: length 17.7
  Bottom Layer w0.254: H8.1 8.38,18.8 10.36,18.8 12.32,16.84 12.32,5.87 H1.35
IO25: length 20.5
  Top Layer w0.254: H1.37 11.07,10.69 13.04,12.66 SW2.4 SW2.3
IO26: length 28.9
  Bottom Layer w0.254: H6.1 9.4,13.84 10.41,12.83 10.41,10.67 6.48,6.73 6.48,1.14 6.98,0.63 17.3,0.63 H1.32
IO28: length 50.6
  Top Layer w0.254: SW3.3 SW3.4 45.52,10.67 28.19,10.67 27.05,9.53 23.24,9.53 22.52,8.81 18.49,8.81 14.99,5.31 14.99,4.19 13.96,3.16 13.15,3.16 12.02,2.03 H1.38
IO29: length 39.8
  Top Layer w0.254: H1.40 9.81,3.3 11.81,3.3 12.49,3.98 12.49,9.69 13.97,11.18 26.36,11.18 27.84,12.66 SW1.4 SW1.3
LED_DAC: length 38.6
  Top Layer w0.254: U1.15 42.47,41.53 v3(39.75,41.53) ; v3(29.46,28.19) 26.42,25.15 17.02,25.15 LED1.1
  Bottom Layer w0.254: v3(29.46,28.19) 30.23,28.96 30.23,31.5 31.2,32.47 33.74,32.47 37.59,36.32 37.59,39.37 v3(39.75,41.53)
MISO: length 56.5
  Top Layer w0.254: v3(34.16,8.51) 34.16,7.34 31.4,4.57
  Bottom Layer w0.254: H9.5 22.1,51.31 22.1,25.4 26.8,20.7 26.8,19.56 34.16,12.19 v3(34.16,8.51)
MOSI: length 88
  Top Layer w0.254: H9.4 19.18,51.69 28.07,51.69 30.23,49.53 v3(40.89,49.53)
  Bottom Layer w0.254: U2.4 44.07,52.71 v3(40.89,49.53) ; H1.19 33.94,7.47 32.85,8.56 32.85,12.62 20.45,25.02 20.45,51.56 19.68,52.32 18.54,52.32 H9.4
RXD: length 43.6
  Top Layer w0.254: 47.34,30.64 46.86,30.16 v3(46.86,27.31) ; U26.6 46.84,41.46 45.77,40.39 45.34,40.39 44.7,39.75 44.7,37.21 47.37,34.54 47.37,30.64
  Bottom Layer w0.254: v3(46.86,27.31) 46.86,10.28 45.59,9.01 45.59,5.13 45.51,5.04 45.51,3.16 H1.10
SCL0: length 48.3
  Bottom Layer w0.254: H10.3 11.05,38.35 11.05,36.58 11.81,35.81 11.81,21.21 17.15,15.88 19.43,15.88 22.86,12.45 22.86,6.35 23.04,6.17 23.93,6.17 25.02,5.08 25.02,3.28 23.78,2.03
SCL1: length 89.1
  Top Layer w0.254: v3(37.97,43.05) v3(37.97,31.75) ; v3(45.97,32.89) 45.97,33.78 44.45,35.31 U1.10 40.89,35.31 v3(39.37,33.78) 39.37,32.51 39.55,32.33 40.98,32.33 R17.2 ; v3(28.07,44.2) 28.07,44.83 25.4,47.5 v3(17.53,47.5)
  Bottom Layer w0.254: v3(28.07,44.2) 36.83,44.2 v3(37.97,43.05) ; v3(37.97,31.75) 38.61,31.75 39.37,32.51 v3(39.37,33.78) ; v3(17.53,47.5) 11.94,47.5 10.54,46.1 H10.1 ; v3(45.97,32.89) 45.97,30.73 51.72,24.99 H1.5
SCLK: length 90.6
  Top Layer w0.254: v3(38.61,47.5) 30.86,47.5 27.43,50.93 19.18,50.93 18.47,51.64 16.31,51.64 16.13,51.82 16.13,52.2 H9.3
  Bottom Layer w0.254: H9.3 16.48,51.84 18.26,51.84 18.8,51.31 18.8,24.51 24.19,19.12 24.19,15.82 28.85,11.15 H1.23 ; v3(38.61,47.5) 38.61,50.69 U2.3
SDA0: length 41.4
  Bottom Layer w0.254: 8.38,38.48 10.16,36.7 10.16,35.56 11.18,34.54 11.18,21.08 16.89,15.37 18.8,15.37 22.1,12.06 22.1,6.25 23.78,4.57
SDA1: length 87.9
  Top Layer w0.254: R18.2 42.6,32.58 U1.9 ; U1.9 44.07,34.04 44.7,33.4 44.7,32.26 45.34,31.62 v3(46.74,31.62) ; U1.9 v3(41.02,34.04) ; v3(37.34,30.73) 37.21,30.86 v3(37.21,42.29) ; v3(17.53,46.36) 24.64,46.36 v3(27.94,43.05)
  Bottom Layer w0.254: v3(17.53,46.36) 13.21,46.36 10.41,43.56 H10.2 ; v3(37.21,42.29) 36.45,43.05 v3(27.94,43.05) ; v3(46.74,31.62) 54.25,24.1 H1.3 ; v3(37.34,30.73) 38.23,30.73 41.02,33.53 v3(41.02,34.04)
TXD: length 41.7
  Top Layer w0.254: v3(48.01,26.67) 48.01,34.92 45.34,37.59 45.34,39.5 45.87,40.03 46.47,40.03 46.63,40.19 U26.7
  Bottom Layer w0.254: 49.18,2.03 47.88,3.33 47.88,10.11 48.01,10.24 v3(48.01,26.67)
$1N1552: length 5.5
  Top Layer w0.254: LED1.2 22.49,27.18 R3.1
$1N3312: length 7.2
  Top Layer w0.254: USB4.4 58.85,39.45 60.69,37.6 R10.2
$1N3313: length 7.1
  Top Layer w0.254: R11.2 60.69,45.59 59.25,44.15 59.25,43.33 58.44,42.52 57.62,42.52 USB4.10
$1N3325: length 4.2
  Top Layer w0.254: U26.8 47.65,38.86 49.4,38.86 49.82,38.44 49.82,36.63
$1N3429: length 5.6
  Top Layer w0.254: R12.1 22.42,49.78 LED2.2
$1N3496: length 5.4
  Top Layer w0.254: R13.1 22.71,44.46 LED3.2
$1N3547: length 5.4
  Top Layer w0.254: LED4.2 22.66,39.12 R14.1
$1N3598: length 5.3
  Top Layer w0.254: LED5.2 22.78,33.78 R15.1
$1N4766: length 5.3
  Top Layer w0.508: BUZZER1.+ 24.65,18.8 Q1.3

## Copper pours and planes (outline as drawn; the poured copper is in the pictures)
GND on Top Layer: 0,56.04 65.02,56.04 65.02,-1.78 0,-1.78
GND on Bottom Layer: 0,56.26 67.06,56.26 67.06,0 0,0

Small or netless copper shapes (teardrops, artwork), in the pictures only: 141 on Top Layer, 72 on Bottom Layer

## Text on the board
Bottom Silkscreen Layer: 树莓派智能家居扩展板 / 板子上的编号均为BCM编号 / 和原理图画的不一样
Top Silkscreen Layer: 3V3 | 26 | 16 | 21 | 20 | GND | MOSI | CE0 | CE1 | MISO | SCK | G | 5 | PWM | 3v3 | 4 | AIN3 | SCL1 | SDA1 | 19 | AIN2 | 18 | AIN1 | 13 | 12 | 6 | 0 | 1 | 17 | 27 | 22 | 23
